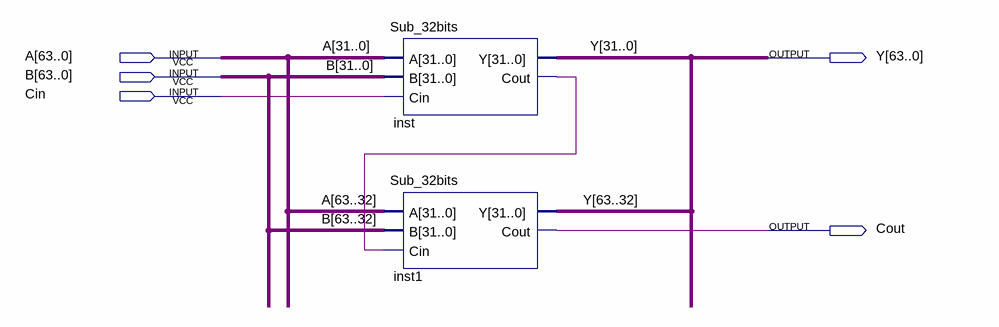
[diagram p0: schematic sheet]
// Quartus schematic Sub_64bits.bdf as structural Verilog: 2 symbols, 5 pins
module Sub_64bits (
  input  [63:0] A,
  input  [63:0] B,
  input  Cin,
  output [63:0] Y,
  output Cout
);

  wire inst_cout;

  Sub_32bits inst (.A(A[31:0]), .B(B[31:0]), .Cin(Cin), .Y(Y[31:0]), .Cout(inst_cout));
  Sub_32bits inst1 (.A(A[63:32]), .B(B[63:32]), .Cin(inst_cout), .Y(Y[63:32]), .Cout(Cout));
endmodule
